# EAGLE design kompass3 (EAGLE 4.16)
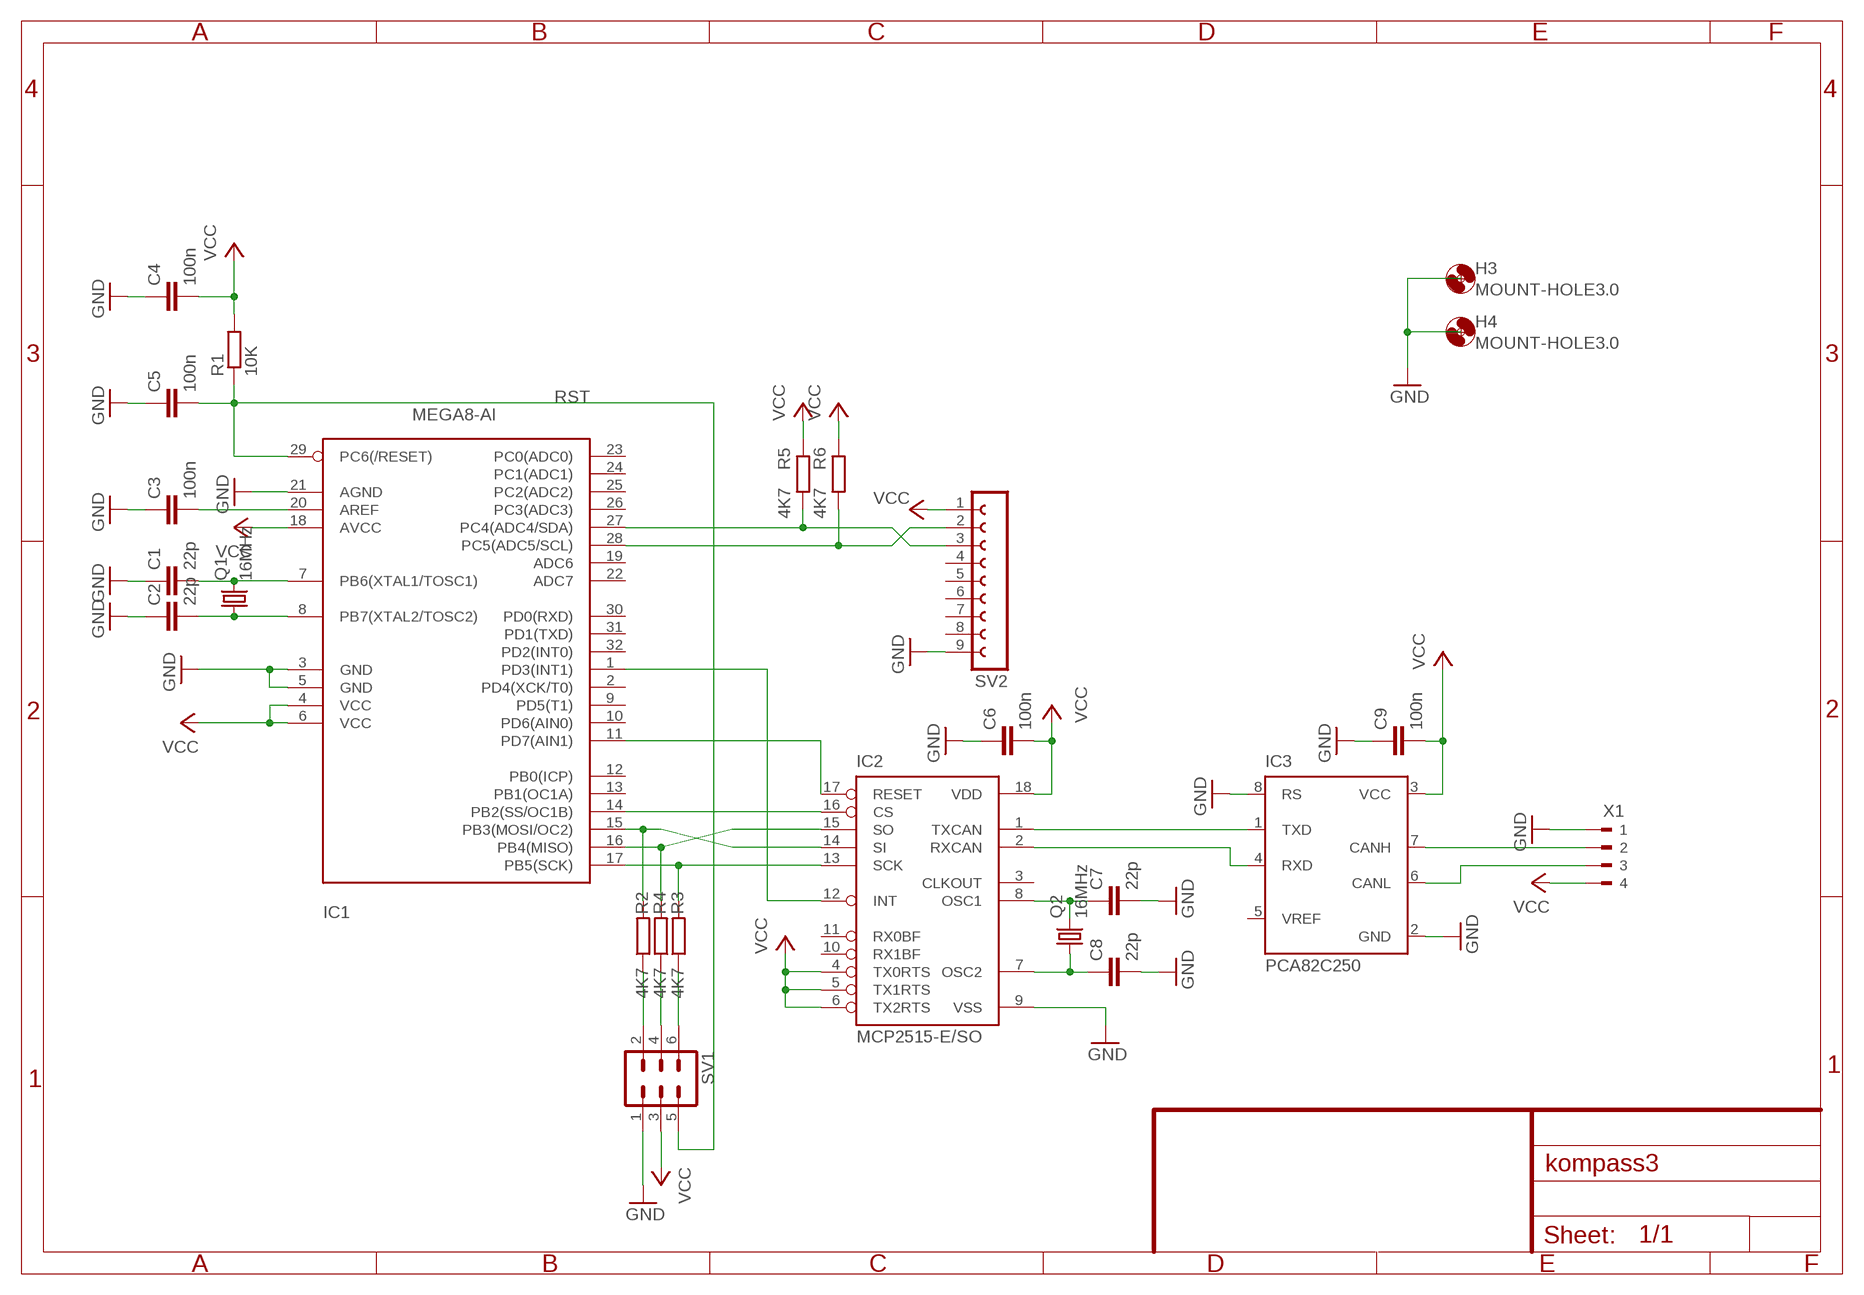
[diagram p0: schematic, sheet 1]

## Parts
C1  22p  C-EUC0603  [C0603]
C2  22p  C-EUC0603  [C0603]
C3  100n  C-EUC0603  [C0603]
C4  100n  C-EUC0603  [C0603]
C5  100n  C-EUC0603  [C0603]
C6  100n  C-EUC0603  [C0603]
C7  22p  C-EUC0603  [C0603]
C8  22p  C-EUC0603  [C0603]
C9  100n  C-EUC0603  [C0603]
H3  MOUNT-HOLE3.0  [3,0]
H4  MOUNT-HOLE3.0  [3,0]
IC1  MEGA8-AI  [TQFP32-08]
IC2  MCP2515-E/SO  [SO18L]
IC3  PCA82C250  [DIL08]
Q1  16MHz  CRYSTALHC49U-V  [HC49U-V]
Q2  16MHz  CRYSTALHC49U-V  [HC49U-V]
R1  10K  R-EU_R0805  [R0805]
R2  4K7  R-EU_R0805  [R0805]
R3  4K7  R-EU_R0805  [R0805]
R4  4K7  R-EU_R0805  [R0805]
R5  4K7  R-EU_R0805  [R0805]
R6  4K7  R-EU_R0805  [R0805]
SV1  MA03-2  [MA03-2]
SV2  FE09-1  [FE09]
X1  90-4  [90-4]

## Nets
GND: C1.1 C2.1 C3.1 C4.1 C5.1 C6.1 C7.2 C8.2 C9.1 IC1.3(GND) IC1.5(GND) IC1.21(AGND) IC2.9(VSS) IC3.2(GND) IC3.8(RS) SV1.1 SV2.9 X1.1
INT: IC1.1(PD3(INT1)) IC2.12(INT)
MISO: IC1.16(PB4(MISO)) IC2.15(SO) R4.2
MOSI: IC1.15(PB3(MOSI/OC2)) IC2.14(SI) R2.2
N$1: IC3.7(CANH) X1.2
N$2: IC3.6(CANL) X1.3
N$3: C1.2 IC1.7(PB6(XTAL1/TOSC1)) Q1.2
N$4: C2.2 IC1.8(PB7(XTAL2/TOSC2)) Q1.1
N$5: C3.2 IC1.20(AREF)
N$6: IC1.11(PD7(AIN1)) IC2.17(RESET)
N$11: IC2.1(TXCAN) IC3.1(TXD)
N$12: IC2.2(RXCAN) IC3.4(RXD)
N$13: C7.1 IC2.8(OSC1) Q2.2
N$14: C8.1 IC2.7(OSC2) Q2.1
N$15: R2.1 SV1.2
N$16: R3.1 SV1.6
N$17: R4.1 SV1.4
RST: C5.2 IC1.29(PC6(/RESET)) R1.1 SV1.5
SCK: IC1.17(PB5(SCK)) IC2.13(SCK) R3.2
SCL: IC1.28(PC5(ADC5/SCL)) R6.1 SV2.2
SDA: IC1.27(PC4(ADC4/SDA)) R5.1 SV2.3
SS: IC1.14(PB2(SS/OC1B)) IC2.16(CS)
VCC: C4.2 C6.2 C9.2 IC1.4(VCC) IC1.6(VCC) IC1.18(AVCC) IC2.4(TX0RTS) IC2.5(TX1RTS) IC2.6(TX2RTS) IC2.18(VDD) IC3.3(VCC) R1.2 R5.2 R6.2 SV1.3 SV2.1 X1.4
Unconnected: IC1.2(PD4(XCK/T0)) IC1.9(PD5(T1)) IC1.10(PD6(AIN0)) IC1.12(PB0(ICP)) IC1.13(PB1(OC1A)) IC1.19(ADC6) IC1.22(ADC7) IC1.23(PC0(ADC0)) IC1.24(PC1(ADC1)) IC1.25(PC2(ADC2)) IC1.26(PC3(ADC3)) IC1.30(PD0(RXD)) IC1.31(PD1(TXD)) IC1.32(PD2(INT0)) IC2.3(CLKOUT) IC2.10(RX1BF) IC2.11(RX0BF) IC3.5(VREF) SV2.4 SV2.5 SV2.6 SV2.7 SV2.8

## Library data of the parts
C1-C9 = rcl:C-EU: CAPACITOR, European symbol
H3 H4 = holes:MOUNT-HOLE: MOUNTING HOLE with drill center marker
IC1 = atmel:MEGA8: MICROCONTROLLER 8 Kbytes FLASH 1 kbytes SRAM 512 bytes EEPROM USART 6-channel 10 bit ADC 2-channel 8 bit ADC Source: avr.lbr
IC2 = mcp2515:MCP2515
IC3 = micro-philips:PCA82C250: CAN CONTROLLER INTERFACE
Q1 Q2 = crystal:CRYSTAL: CRYSTAL
R1-R6 = rcl:R-EU_: RESISTOR, European symbol
SV1 = con-lstb:MA03-2: PIN HEADER
SV2 = con-lsta:FE09-1: FEMALE HEADER
X1 = con-weidmueller-sl35:90-4: WEIDMUELLER CLAMP CONNECTOR

## Board
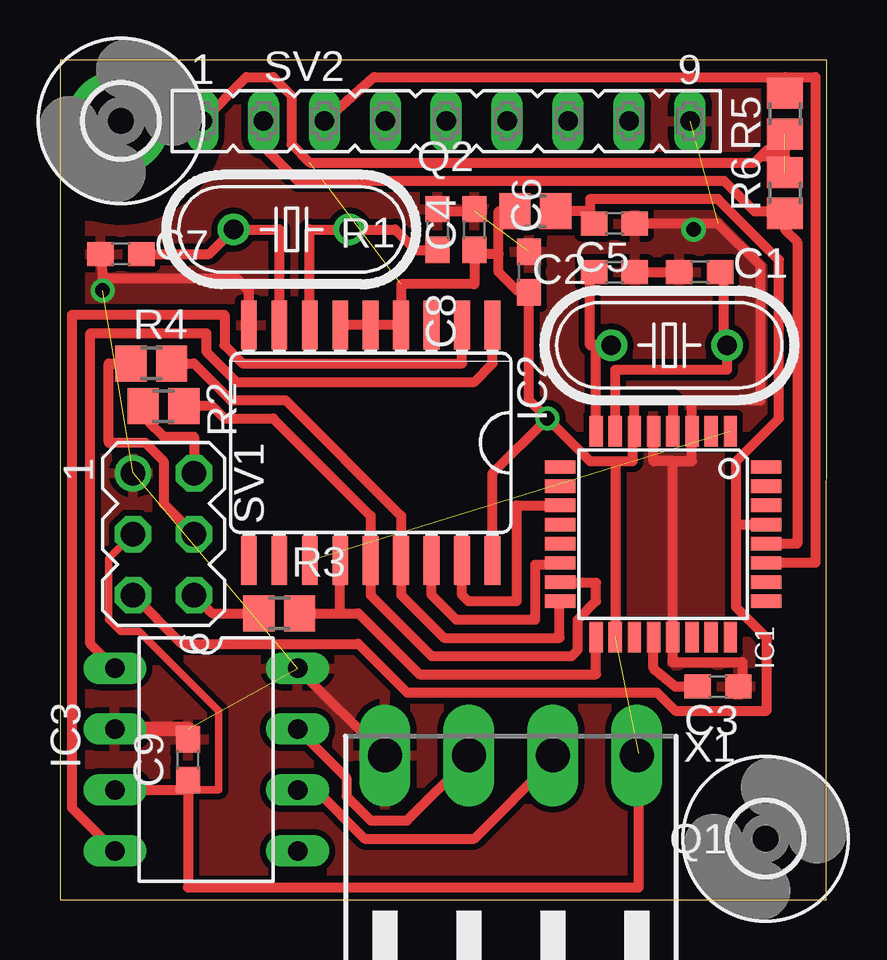
[diagram p1: board, top side]
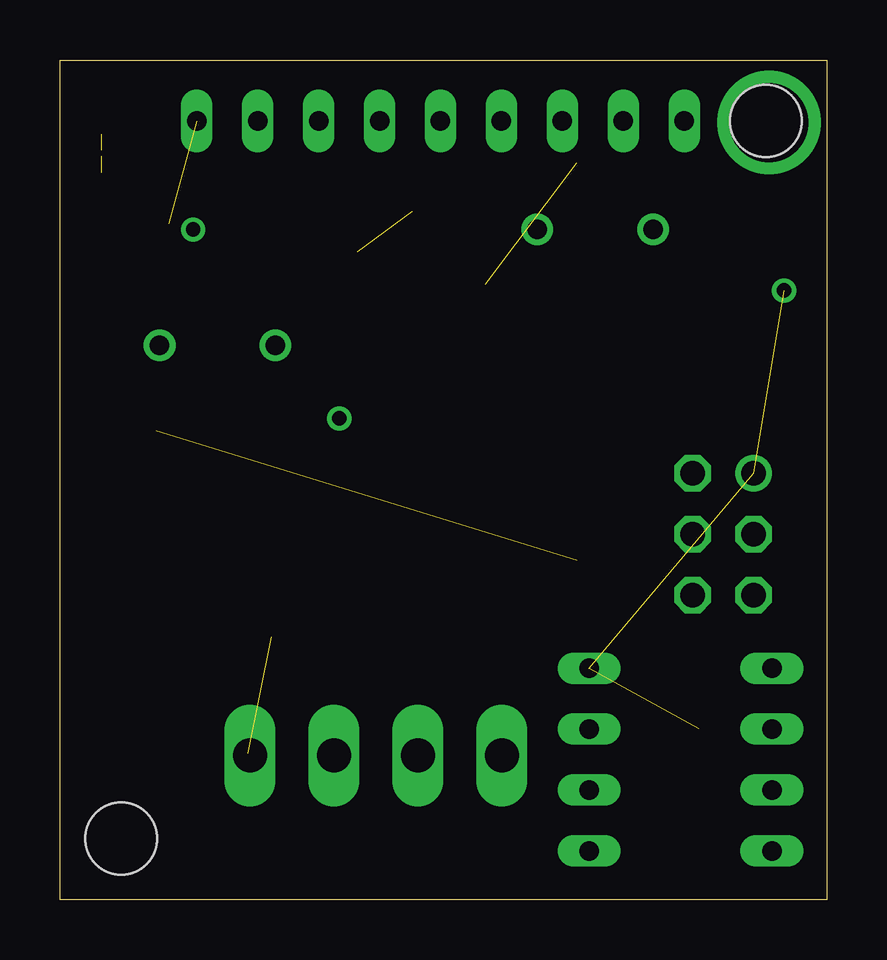
[diagram p2: board, bottom side, seen from below]

Size 31.97 x 35.01 mm. Coordinates in mm from the lower left corner, seen from the top.
Outline: 0,0 31.95,0 31.97,35.01 0,35 0,0
Copper layers (1*16): Top 0.035mm / dielectric 1.5mm / Bottom 0.035mm
Design rules "olimex_8mils": minimum track width 10mil, minimum drill 24mil, track to track 8mil, track to pad 8mil, pad to pad 8mil, via to via 8mil, smd to smd 8mil, copper to edge 40mil, drill to drill 10mil, minimum pad ring 10mil, minimum via ring 8mil, stop-mask expansion 0mil, vias tented up to drill 0mil, thermal gap 10mil

### Footprints (pad centres in the part's own frame; a part is rotated, then mirrored left to right if it is on the bottom)
C0603 = smd 1.1 x 1: 1 -0.85,0; 2 0.85,0
3,0 = hole 3: 0,0
TQFP32-08 = smd 1.27 x 0.559: 1 -4.293,2.8; 2 -4.293,2; 3 -4.293,1.2; 4 -4.293,0.4; 5 -4.293,-0.4; 6 -4.293,-1.2; 7 -4.293,-2; 8 -4.293,-2.8; 17 4.293,-2.8; 18 4.293,-2; 19 4.293,-1.2; 20 4.293,-0.4; 21 4.293,0.4; 22 4.293,1.2; 23 4.293,2; 24 4.293,2.8 | smd 0.559 x 1.27: 9 -2.8,-4.293; 10 -2,-4.293; 11 -1.2,-4.293; 12 -0.4,-4.293; 13 0.4,-4.293; 14 1.2,-4.293; 15 2,-4.293; 16 2.8,-4.293; 25 2.8,4.293; 26 2,4.293; 27 1.2,4.293; 28 0.4,4.293; 29 -0.4,4.293; 30 -1.2,4.293; 31 -2,4.293; 32 -2.8,4.293
SO18L = smd 0.66 x 2.032: 1 -5.08,-4.902; 2 -3.81,-4.902; 3 -2.54,-4.902; 4 -1.27,-4.902; 5 0,-4.902; 6 1.27,-4.902; 7 2.54,-4.902; 8 3.81,-4.902; 9 5.08,-4.902; 10 5.08,4.902; 11 3.81,4.902; 12 2.54,4.902; 13 1.27,4.902; 14 0,4.902; 15 -1.27,4.902; 16 -2.54,4.902; 17 -3.81,4.902; 18 -5.08,4.902
DIL08 = drill 0.813 long: 1 -3.81,-3.81; 2 -1.27,-3.81; 3 1.27,-3.81; 4 3.81,-3.81; 5 3.81,3.81; 6 1.27,3.81; 7 -1.27,3.81; 8 -3.81,3.81
HC49U-V = drill 0.813 round: 1 -2.413,0; 2 2.413,0
R0805 = smd 1.3 x 1.5: 1 -0.85,0; 2 0.85,0
MA03-2 = drill 1.016 round: 1 -2.54,-1.27 | drill 1.016 octagon: 2 -2.54,1.27; 3 0,-1.27; 4 0,1.27; 5 2.54,-1.27; 6 2.54,1.27
FE09 = drill 0.813 long: 1 -10.16,0; 2 -7.62,0; 3 -5.08,0; 4 -2.54,0; 5 0,0; 6 2.54,0; 7 5.08,0; 8 7.62,0; 9 10.16,0
90-4 = drill 1.422 long: 1 -5.25,5.25; 2 -1.75,5.25; 3 1.75,5.25; 4 5.25,5.25

### Placement (x,y rotation side)
C1  26.67,26.16 0 top
C2  23.11,26.16 180 top
C3  27.43,8.89 180 top
C4  17.27,27.94 270 top
C5  23.11,28.19 180 top
C6  19.56,26.16 270 top
C7  2.54,26.92 180 top
C8  15.75,27.94 90 top
C9  5.33,5.84 270 top
H3  2.54,32.46 0 top
H4  29.41,2.54 0 top
IC1  25.15,15.24 270 top
IC2  12.95,19.05 180 top
IC3  6.1,5.84 270 top
Q1  25.4,23.11 0 top
Q2  9.65,27.94 180 top
R1  19.81,28.7 180 top
R2  4.32,20.57 0 top
R3  9.14,11.94 0 top
R4  3.81,22.35 0 top
R5  30.23,32.76 270 top
R6  30.23,29.46 90 top
SV1  4.32,15.24 270 top
SV2  16.1,32.46 0 top
X1  18.8,0.76 0 top

### Tracks (layer width: path | path; a pad name or v marks a point on that pad's centre or on a via)
GND  (via drill 0.6)  (5 unrouted)
  Top 0.406: IC3.8 X1.1 | C4.1 17.27,28.7 15.75,28.7 C8.2 | IC1.5 24.75,18.29 25.4,18.29 | 25.4,18.29 26.35,18.29 IC1.3 26.35,20.83 29.21,20.83 29.21,26.41 27.43,28.19 C5.1 | 25.4,18.29 25.55,18.29 IC1.21 25.55,9.9 28.45,9.9 28.45,8.89 C3.1 | IC2.9 7.87,25.4 7.37,25.91 1.78,25.91 C7.2 | C2.1 C1.1
  Top 0.61: C9.1 5.33,7.11 IC3.2
  other vias: 1.78,25.4 26.42,27.94
  pour Top (isolate 0.254): 0.25,0.25 31.75,0.25 31.75,34.8 0.25,34.8
INT  (1 unrouted)
MISO
  Top 0.406: IC1.16 20.83,12.44 20.83,10.92 16,10.92 14.22,12.7 IC2.15 14.22,16 9.4,20.83 7.11,20.83 5.59,22.35 R4.2
MOSI
  Top 0.406: IC1.15 20.85,13.21 22.35,13.21 22.35,12.44 21.59,11.68 21.59,10.41 21.34,10.16 15.49,10.16 12.95,12.7 IC2.14 12.95,16 8.89,20.06 6.86,20.06 6.35,20.57 R2.2
N$1
  Top 0.406: IC3.7 11.94,5.08 11.94,4.32 12.95,3.3 14.48,3.3 17.05,5.87 X1.2
N$2
  Top 0.406: IC3.6 10.67,4.57 12.7,2.54 17.27,2.54 20.57,5.84 20.55,5.87 X1.3
N$3
  Top 0.406: C1.2 27.69,26.41 27.69,23.11 Q1.2 27.81,22.1 23.15,22.1 IC1.7
N$4
  Top 0.406: C2.2 22.1,26.41 22.1,23.11 | IC1.8 22.35,23.11 22.1,23.11 | 22.1,23.11 Q1.1
N$5
  Top 0.406: IC1.20 24.75,9.65 25.65,8.89 C3.2
N$6
  Top 0.406: IC2.17 16.76,12.7 17.02,12.44 19.05,12.44 19.05,16.44 IC1.11
N$7  (via drill 3.3)
  other vias: 2.41,32.39
N$11
  Top 0.406: IC3.1 1.27,10.67 1.27,23.62 6.1,23.62 6.1,22.86 7.37,21.59 17.27,21.59 18.03,22.35 IC2.1
N$12
  Top 0.406: IC3.4 0.51,3.81 0.51,24.38 6.86,24.38 6.86,23.11 7.62,22.35 16.76,22.35 IC2.2
N$13
  Top 0.406: IC2.8 9.14,27.94 Q2.2 6.22,26.92 C7.1 3.3,27.18
N$14
  Top 0.406: C8.1 14.82,27.09 13.97,27.94 Q2.1 10.41,27.94 IC2.7
N$15
  Top 0.406: R2.1 3.72,19.9 4.32,19.3 5.59,19.3 SV1.2
N$16
  Top 0.406: R3.1 6.35,11.94 SV1.6
N$17
  Top 0.406: SV1.4 4.32,16.51 4.32,18.29 3.56,19.05 2.03,19.05 2.03,22.35 R4.1
RST
  Top 0.406: 28.19,15.64 IC1.29 | 28.19,15.64 28.19,18.29 29.97,20.06 29.97,26.67 27.43,29.21 22.1,29.21 22.1,27.94 C5.2 22.1,28.19 22.1,28.7 R1.1 20.57,28.19 | SV1.5 5.08,10.67 12.45,10.67 14.48,8.63 24.89,8.63 25.65,7.87 29.46,7.87 29.46,10.92 28.19,12.19 28.19,15.64
SCK
  Top 0.406: 11.68,11.94 IC2.13 | 11.68,11.94 12.45,11.94 14.99,9.4 22.35,9.4 IC1.17 | R3.2 11.68,11.94
SCL
  Top 0.406: IC1.28 30.73,14.84 30.73,27.43 30.23,27.94 R6.1 30.23,28.7 28.96,28.7 27.69,29.97 9.91,29.97 8.48,31.39 SV2.2
SDA
  Top 0.406: IC1.27 31.5,14.04 31.5,34.29 30.23,34.29 | SV2.3 13.1,34.29 30.23,34.29 | 30.23,34.29 R5.1
SS
  Top 0.406: IC1.14 20.85,13.99 20.83,13.97 19.81,13.97 19.81,11.68 16.51,11.68 15.49,12.7 IC2.16
VCC  (via drill 0.6)  (4 unrouted)
  Top 0.305: 5.33,4.57 6.6,4.57 6.6,7.87 3.3,11.17 2.54,11.17 2.03,11.68 2.03,14.22 SV1.3
  Top 0.406: IC3.3 5.33,4.57 5.33,0.51 24.13,0.51 24.13,5.93 | SV2.1 7.77,34.29 8.89,34.29 9.65,33.53 9.65,31.49 10.41,30.73 28.96,30.73 29.21,30.99 | 29.21,30.99 30.23,30.99 30.23,31.24 29.46,31.24 29.21,30.99 | 18.29,26.92 18.29,28.7 R1.2 | 18.29,26.92 17.27,26.92 C4.2 17.27,25.65 14.22,25.65 IC2.4 | IC2.18 18.03,17.78 v20.32,20.06 | v20.32,20.06 22.1,18.29 23.11,18.29 | 23.11,18.29 23.88,18.29 23.88,19.3 23.95,19.37 IC1.6 23.95,20.83 25.55,20.83 IC1.4 | IC1.18 23.15,18.25 23.11,18.29 | IC2.5 IC2.6 11.68,24.13 | IC2.4 IC2.5 | IC2.4 IC2.5 | IC2.4 14.22,23.87 | v20.32,20.06 19.56,20.83 C6.2 19.56,25.4 19.05,25.4 18.29,26.16 18.29,26.92
  Top 0.61: 24.13,5.93 X1.4 | 5.33,4.57 C9.2
  Bottom 0.406: X1.4 24.13,6.09